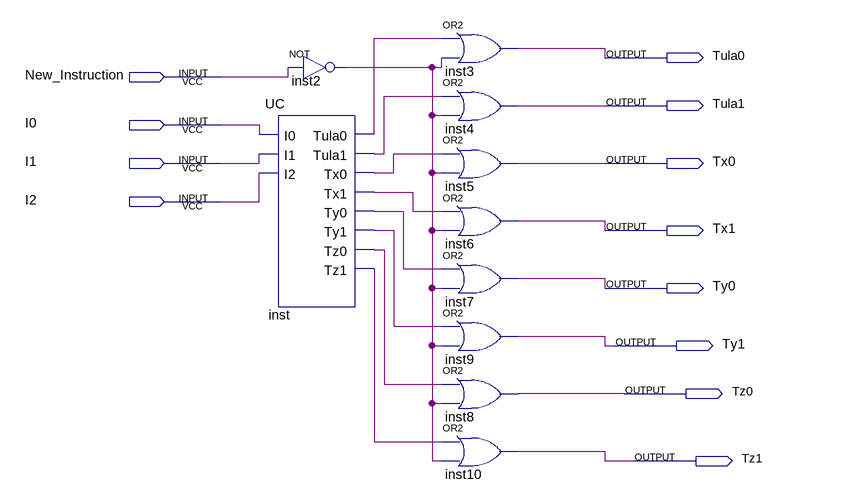
[diagram p0: schematic sheet]
// Quartus schematic UC2.bdf as structural Verilog: 10 symbols, 12 pins
module UC2 (
  input  New_Instruction,
  input  I0,
  input  I1,
  input  I2,
  output Tula0,
  output Tula1,
  output Tx0,
  output Tx1,
  output Ty0,
  output Ty1,
  output Tz0,
  output Tz1
);

  wire inst2_out, inst_tula0, inst_tula1, inst_tx0, inst_tx1, inst_ty0, inst_ty1, inst_tz0, inst_tz1;

  not inst2 (inst2_out, New_Instruction);
  UC inst (
    .I0(I0), .I1(I1), .I2(I2), .Tula0(inst_tula0), .Tula1(inst_tula1), .Tx0(inst_tx0), .Tx1(inst_tx1),
    .Ty0(inst_ty0), .Ty1(inst_ty1), .Tz0(inst_tz0), .Tz1(inst_tz1));
  or inst3 (Tula0, inst_tula0, inst2_out);
  or inst4 (Tula1, inst_tula1, inst2_out);
  or inst5 (Tx0, inst_tx0, inst2_out);
  or inst6 (Tx1, inst_tx1, inst2_out);
  or inst7 (Ty0, inst_ty0, inst2_out);
  or inst9 (Ty1, inst_ty1, inst2_out);
  or inst8 (Tz0, inst_tz0, inst2_out);
  or inst10 (Tz1, inst_tz1, inst2_out);
endmodule
